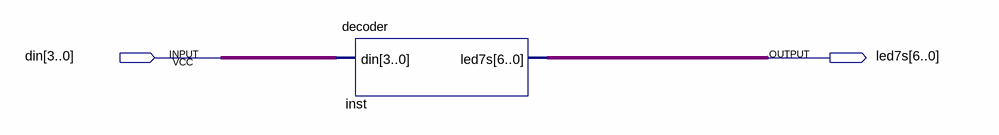
[diagram p0: schematic sheet]
// Quartus schematic decoder1.bdf as structural Verilog: 1 symbols, 2 pins
module decoder1 (
  input  [3:0] din,
  output [6:0] led7s
);

  decoder inst (.din(din), .led7s(led7s));
endmodule
